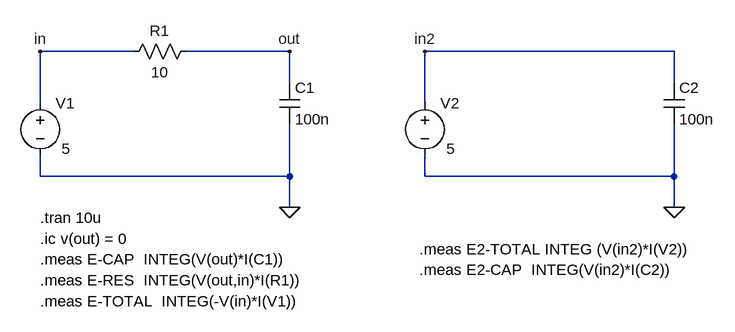
[diagram p0: schematic power.asc]
power.asc, the LTspice schematic file:
Version 4
SHEET 1 1204 680
WIRE 304 -48 160 -48
WIRE 544 -48 384 -48
WIRE 1136 -48 752 -48
WIRE 544 0 544 -48
WIRE 1136 0 1136 -48
WIRE 160 32 160 -48
WIRE 752 32 752 -48
WIRE 160 144 160 112
WIRE 544 144 544 64
WIRE 544 144 160 144
WIRE 752 144 752 112
WIRE 1136 144 1136 64
WIRE 1136 144 752 144
WIRE 544 192 544 144
WIRE 1136 192 1136 144
FLAG 544 192 0
FLAG 160 -48 in
FLAG 544 -48 out
FLAG 1136 192 0
FLAG 752 -48 in2
SYMBOL res 400 -64 R90
WINDOW 0 0 56 VBottom 2
WINDOW 3 32 56 VTop 2
SYMATTR InstName R1
SYMATTR Value 10
SYMBOL cap 528 0 R0
SYMATTR InstName C1
SYMATTR Value 100n
SYMBOL voltage 160 16 R0
WINDOW 3 33 86 Left 2
WINDOW 123 0 0 Left 2
WINDOW 39 0 0 Left 2
SYMATTR Value 5
SYMATTR InstName V1
SYMBOL cap 1120 0 R0
SYMATTR InstName C2
SYMATTR Value 100n
SYMBOL voltage 752 16 R0
WINDOW 3 33 86 Left 2
WINDOW 123 0 0 Left 2
WINDOW 39 0 0 Left 2
SYMATTR Value 5
SYMATTR InstName V2
TEXT 160 208 Left 2 !.tran 10u
TEXT 160 240 Left 2 !.ic v(out) = 0
TEXT 160 272 Left 2 !.meas E-CAP  INTEG(V(out)*I(C1))
TEXT 160 304 Left 2 !.meas E-RES  INTEG(V(out,in)*I(R1))
TEXT 160 336 Left 2 !.meas E-TOTAL  INTEG(-V(in)*I(V1))
TEXT 744 256 Left 2 !.meas E2-TOTAL INTEG (V(in2)*I(V2))
TEXT 744 288 Left 2 !.meas E2-CAP  INTEG(V(in2)*I(C2))

The netlist it stands for:
* power.asc
R1 out in 10
C1 out 0 100n
V1 in 0 5
C2 in2 0 100n
V2 in2 0 5
.tran 10u
.ic v(out) = 0
.meas E-CAP  INTEG(V(out)*I(C1))
.meas E-RES  INTEG(V(out,in)*I(R1))
.meas E-TOTAL  INTEG(-V(in)*I(V1))
.meas E2-TOTAL INTEG (V(in2)*I(V2))
.meas E2-CAP  INTEG(V(in2)*I(C2))
.backanno
.end